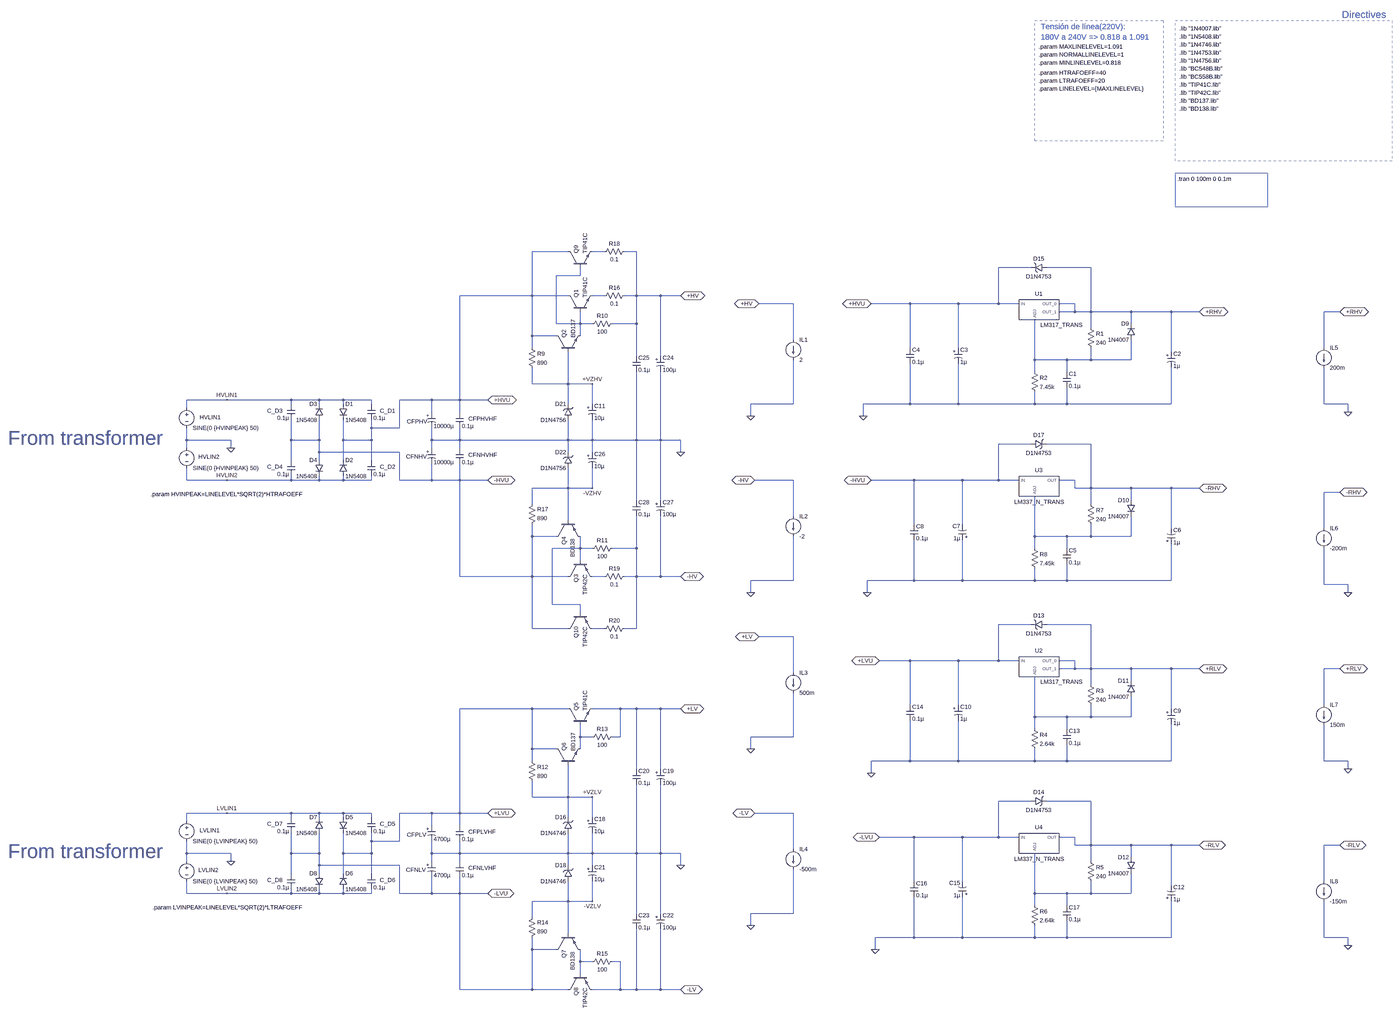
[diagram p0: schematic power_supply_V_1.0b.asc, whole sheet]
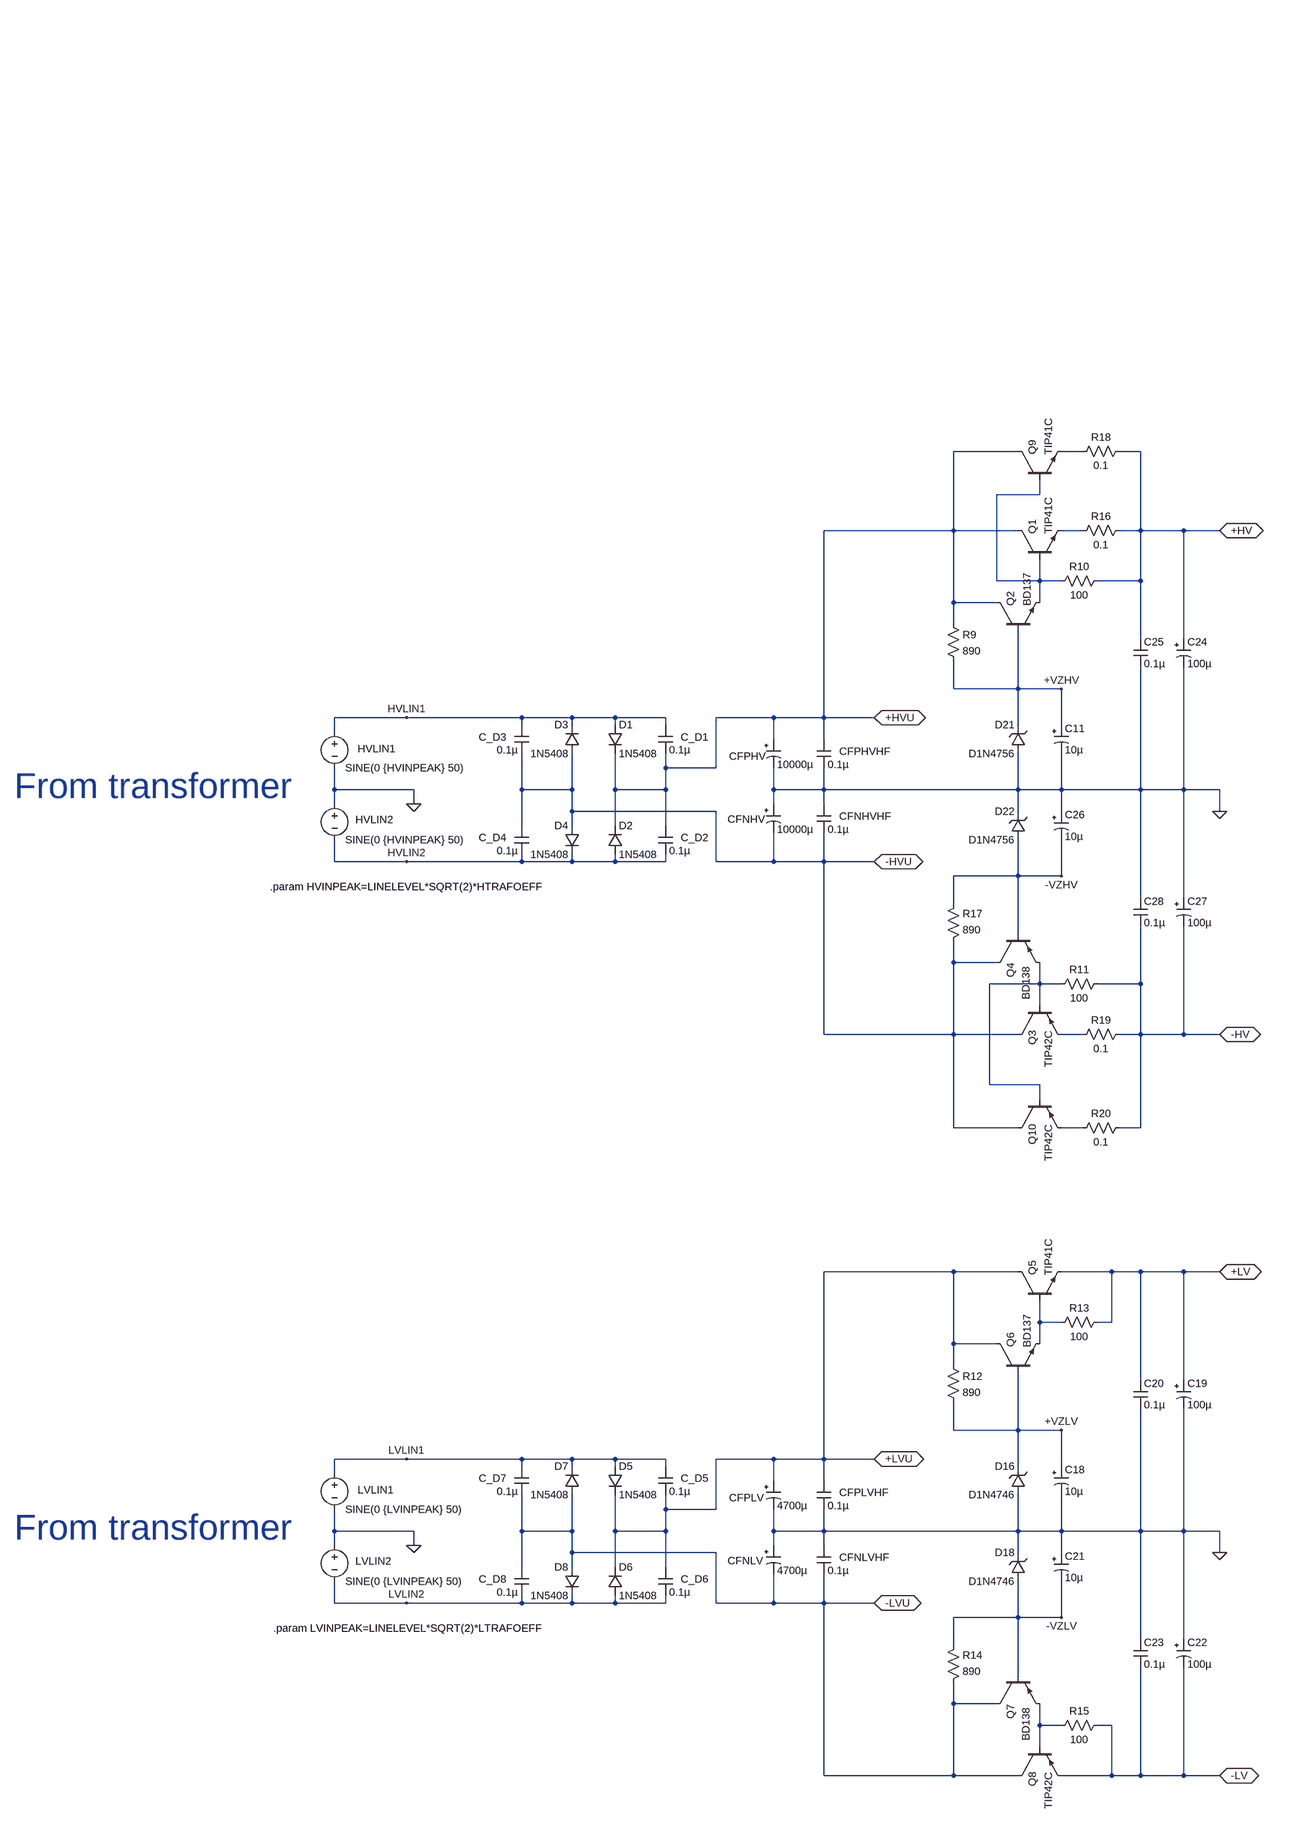
[diagram p1: schematic power_supply_V_1.0b.asc, part, row 1 of 1, column 1 of 2]
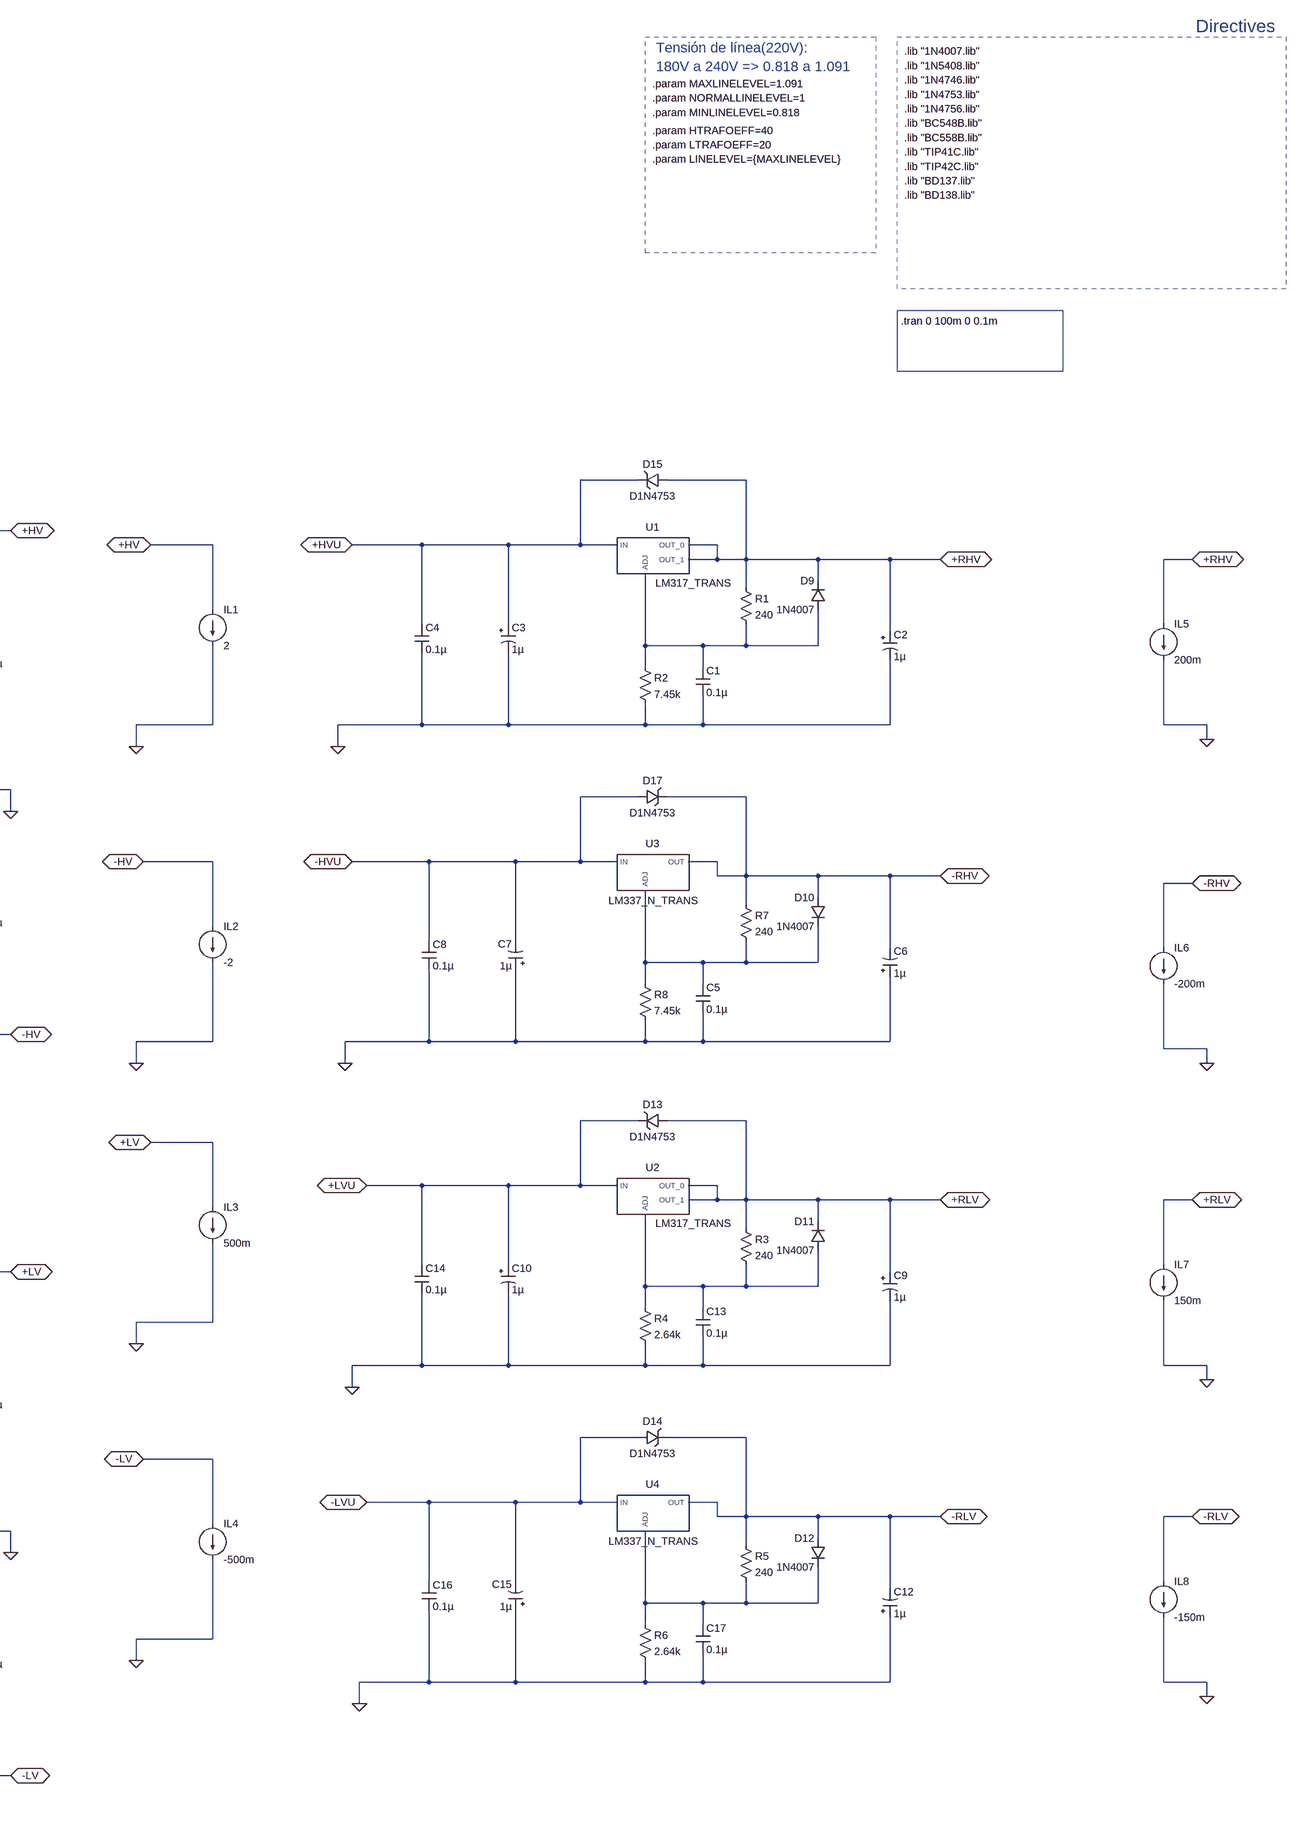
[diagram p2: schematic power_supply_V_1.0b.asc, part, row 1 of 1, column 2 of 2]
power_supply_V_1.0b.asc, the LTspice schematic file:
Version 4
SHEET 1 5728 3116
WIRE 240 -688 96 -688
WIRE 384 -688 336 -688
WIRE 512 -688 464 -688
WIRE 3248 -624 3120 -624
WIRE 3488 -624 3312 -624
WIRE 288 -592 288 -624
WIRE 288 -592 192 -592
WIRE 96 -512 96 -688
WIRE 96 -512 -192 -512
WIRE 240 -512 96 -512
WIRE 384 -512 336 -512
WIRE 512 -512 512 -688
WIRE 512 -512 464 -512
WIRE 608 -512 512 -512
WIRE 688 -512 608 -512
WIRE 2112 -480 1936 -480
WIRE 2704 -480 2544 -480
WIRE 2896 -480 2704 -480
WIRE 3120 -480 3120 -624
WIRE 3120 -480 2896 -480
WIRE 3200 -480 3120 -480
WIRE 3424 -480 3360 -480
WIRE 3424 -448 3424 -480
WIRE 3424 -448 3360 -448
WIRE 3488 -448 3488 -624
WIRE 3488 -448 3424 -448
WIRE 3648 -448 3488 -448
WIRE 3808 -448 3648 -448
WIRE 3920 -448 3808 -448
WIRE 4480 -448 4416 -448
WIRE 192 -400 192 -592
WIRE 288 -400 288 -448
WIRE 288 -400 192 -400
WIRE 336 -400 288 -400
WIRE 512 -400 512 -512
WIRE 512 -400 416 -400
WIRE 3648 -400 3648 -448
WIRE 3488 -384 3488 -448
WIRE 96 -352 96 -512
WIRE 192 -352 96 -352
WIRE 288 -352 288 -400
WIRE 2112 -336 2112 -480
WIRE 96 -304 96 -352
WIRE 2704 -304 2704 -480
WIRE 2896 -304 2896 -480
WIRE 4416 -304 4416 -448
WIRE 3808 -288 3808 -448
WIRE 512 -272 512 -400
WIRE 608 -272 608 -512
WIRE 3264 -256 3264 -416
WIRE 3392 -256 3264 -256
WIRE 3488 -256 3488 -304
WIRE 3488 -256 3392 -256
WIRE 3648 -256 3648 -336
WIRE 3648 -256 3488 -256
WIRE 3264 -208 3264 -256
WIRE 3392 -208 3392 -256
WIRE 96 -160 96 -224
WIRE 240 -160 240 -288
WIRE 240 -160 96 -160
WIRE 336 -160 240 -160
WIRE -1120 -96 -1280 -96
WIRE -864 -96 -1120 -96
WIRE -752 -96 -864 -96
WIRE -656 -96 -752 -96
WIRE -544 -96 -656 -96
WIRE -304 -96 -432 -96
WIRE -192 -96 -192 -512
WIRE -192 -96 -304 -96
WIRE -80 -96 -192 -96
WIRE -864 -80 -864 -96
WIRE -752 -80 -752 -96
WIRE -656 -80 -656 -96
WIRE -544 -80 -544 -96
WIRE 240 -80 240 -160
WIRE 336 -80 336 -160
WIRE 2112 -80 2112 -256
WIRE 2112 -80 1904 -80
WIRE 2704 -80 2704 -240
WIRE 2704 -80 2512 -80
WIRE 2896 -80 2896 -240
WIRE 2896 -80 2704 -80
WIRE 3264 -80 3264 -128
WIRE 3264 -80 2896 -80
WIRE 3392 -80 3392 -144
WIRE 3392 -80 3264 -80
WIRE 3808 -80 3808 -224
WIRE 3808 -80 3392 -80
WIRE 4416 -80 4416 -224
WIRE 4512 -80 4416 -80
WIRE -1280 -64 -1280 -96
WIRE -304 -48 -304 -96
WIRE -192 -48 -192 -96
WIRE 4512 -48 4512 -80
WIRE 1904 -32 1904 -80
WIRE 2512 -32 2512 -80
WIRE -544 16 -544 -16
WIRE -432 16 -432 -96
WIRE -432 16 -544 16
WIRE -1280 64 -1280 16
WIRE -1104 64 -1280 64
WIRE -864 64 -864 -16
WIRE -752 64 -752 -16
WIRE -752 64 -864 64
WIRE -656 64 -656 -16
WIRE -544 64 -544 16
WIRE -544 64 -656 64
WIRE -304 64 -304 16
WIRE -192 64 -192 16
WIRE -192 64 -304 64
WIRE 240 64 240 -16
WIRE 240 64 -192 64
WIRE 336 64 336 -16
WIRE 336 64 240 64
WIRE 512 64 512 -208
WIRE 512 64 336 64
WIRE 608 64 608 -208
WIRE 608 64 512 64
WIRE 688 64 608 64
WIRE 3248 80 3120 80
WIRE 3488 80 3312 80
WIRE -1280 96 -1280 64
WIRE -1104 96 -1104 64
WIRE -304 96 -304 64
WIRE -192 96 -192 64
WIRE -752 112 -752 64
WIRE -432 112 -752 112
WIRE 240 112 240 64
WIRE 336 112 336 64
WIRE 688 112 688 64
WIRE -864 144 -864 64
WIRE -752 144 -752 112
WIRE -656 144 -656 64
WIRE -544 144 -544 64
WIRE -1280 224 -1280 176
WIRE -1120 224 -1280 224
WIRE -864 224 -864 208
WIRE -864 224 -1120 224
WIRE -752 224 -752 208
WIRE -752 224 -864 224
WIRE -656 224 -656 208
WIRE -656 224 -752 224
WIRE -544 224 -544 208
WIRE -544 224 -656 224
WIRE -432 224 -432 112
WIRE -304 224 -304 160
WIRE -304 224 -432 224
WIRE -192 224 -192 160
WIRE -192 224 -304 224
WIRE -80 224 -192 224
WIRE 2112 224 1920 224
WIRE 2720 224 2544 224
WIRE 2912 224 2720 224
WIRE 3120 224 3120 80
WIRE 3120 224 2912 224
WIRE 3200 224 3120 224
WIRE 3424 224 3360 224
WIRE 240 256 240 176
WIRE 240 256 96 256
WIRE 336 256 336 176
WIRE 336 256 240 256
WIRE 3424 256 3424 224
WIRE 3488 256 3488 80
WIRE 3488 256 3424 256
WIRE 3648 256 3488 256
WIRE 3808 256 3648 256
WIRE 3920 256 3808 256
WIRE 4480 272 4416 272
WIRE 512 304 512 64
WIRE 608 304 608 64
WIRE 3648 304 3648 256
WIRE 96 320 96 256
WIRE 3488 320 3488 256
WIRE 2112 368 2112 224
WIRE 240 384 240 256
WIRE 2720 400 2720 224
WIRE 2912 400 2912 224
WIRE 3808 416 3808 256
WIRE 4416 416 4416 272
WIRE 96 448 96 400
WIRE 192 448 96 448
WIRE 3264 448 3264 288
WIRE 3392 448 3264 448
WIRE 3488 448 3488 400
WIRE 3488 448 3392 448
WIRE 3648 448 3648 368
WIRE 3648 448 3488 448
WIRE 288 496 288 448
WIRE 288 496 176 496
WIRE 336 496 288 496
WIRE 512 496 512 368
WIRE 512 496 416 496
WIRE 3264 496 3264 448
WIRE 3392 496 3392 448
WIRE 288 544 288 496
WIRE -192 608 -192 224
WIRE 96 608 96 448
WIRE 96 608 -192 608
WIRE 240 608 96 608
WIRE 384 608 336 608
WIRE 512 608 512 496
WIRE 512 608 464 608
WIRE 608 608 608 368
WIRE 608 608 512 608
WIRE 688 608 608 608
WIRE 2112 624 2112 448
WIRE 2112 624 1904 624
WIRE 2720 624 2720 464
WIRE 2720 624 2528 624
WIRE 2912 624 2912 464
WIRE 2912 624 2720 624
WIRE 3264 624 3264 576
WIRE 3264 624 2912 624
WIRE 3392 624 3392 560
WIRE 3392 624 3264 624
WIRE 3808 624 3808 480
WIRE 3808 624 3392 624
WIRE 4416 640 4416 496
WIRE 4512 640 4416 640
WIRE 1904 672 1904 624
WIRE 2528 672 2528 624
WIRE 4512 672 4512 640
WIRE 176 720 176 496
WIRE 288 720 176 720
WIRE 288 752 288 720
WIRE 3248 800 3120 800
WIRE 3488 800 3312 800
WIRE 96 816 96 608
WIRE 240 816 96 816
WIRE 384 816 336 816
WIRE 512 816 512 608
WIRE 512 816 464 816
WIRE 2112 848 1936 848
WIRE 2704 944 2576 944
WIRE 2896 944 2704 944
WIRE 3120 944 3120 800
WIRE 3120 944 2896 944
WIRE 3200 944 3120 944
WIRE 3424 944 3360 944
WIRE 3424 976 3424 944
WIRE 3424 976 3360 976
WIRE 3488 976 3488 800
WIRE 3488 976 3424 976
WIRE 3648 976 3488 976
WIRE 3808 976 3648 976
WIRE 3920 976 3808 976
WIRE 4480 976 4416 976
WIRE 2112 992 2112 848
WIRE 3648 1024 3648 976
WIRE 3488 1040 3488 976
WIRE 2704 1120 2704 944
WIRE 2896 1120 2896 944
WIRE 4416 1120 4416 976
WIRE 96 1136 -192 1136
WIRE 240 1136 96 1136
WIRE 448 1136 336 1136
WIRE 512 1136 448 1136
WIRE 608 1136 512 1136
WIRE 688 1136 608 1136
WIRE 3808 1136 3808 976
WIRE 3264 1168 3264 1008
WIRE 3392 1168 3264 1168
WIRE 3488 1168 3488 1120
WIRE 3488 1168 3392 1168
WIRE 3648 1168 3648 1088
WIRE 3648 1168 3488 1168
WIRE 3264 1216 3264 1168
WIRE 3392 1216 3392 1168
WIRE 288 1248 288 1200
WIRE 336 1248 288 1248
WIRE 448 1248 448 1136
WIRE 448 1248 416 1248
WIRE 2112 1248 2112 1072
WIRE 2112 1248 1904 1248
WIRE 96 1296 96 1136
WIRE 192 1296 96 1296
WIRE 288 1296 288 1248
WIRE 1904 1296 1904 1248
WIRE 96 1344 96 1296
WIRE 2704 1344 2704 1184
WIRE 2704 1344 2544 1344
WIRE 2896 1344 2896 1184
WIRE 2896 1344 2704 1344
WIRE 3264 1344 3264 1296
WIRE 3264 1344 2896 1344
WIRE 3392 1344 3392 1280
WIRE 3392 1344 3264 1344
WIRE 3808 1344 3808 1200
WIRE 3808 1344 3392 1344
WIRE 4416 1344 4416 1200
WIRE 4512 1344 4416 1344
WIRE 512 1376 512 1136
WIRE 608 1376 608 1136
WIRE 4512 1376 4512 1344
WIRE 2544 1392 2544 1344
WIRE 96 1488 96 1424
WIRE 240 1488 240 1360
WIRE 240 1488 96 1488
WIRE 336 1488 240 1488
WIRE 3248 1504 3120 1504
WIRE 3488 1504 3312 1504
WIRE -1120 1552 -1280 1552
WIRE -864 1552 -1120 1552
WIRE -752 1552 -864 1552
WIRE -656 1552 -752 1552
WIRE -544 1552 -656 1552
WIRE -304 1552 -432 1552
WIRE -192 1552 -192 1136
WIRE -192 1552 -304 1552
WIRE -80 1552 -192 1552
WIRE 2112 1552 1920 1552
WIRE -864 1568 -864 1552
WIRE -752 1568 -752 1552
WIRE -656 1568 -656 1552
WIRE -544 1568 -544 1552
WIRE 240 1568 240 1488
WIRE 336 1568 336 1488
WIRE -1280 1584 -1280 1552
WIRE -304 1600 -304 1552
WIRE -192 1600 -192 1552
WIRE 2720 1648 2576 1648
WIRE 2912 1648 2720 1648
WIRE 3120 1648 3120 1504
WIRE 3120 1648 2912 1648
WIRE 3200 1648 3120 1648
WIRE 3424 1648 3360 1648
WIRE -544 1664 -544 1632
WIRE -432 1664 -432 1552
WIRE -432 1664 -544 1664
WIRE 3424 1680 3424 1648
WIRE 3488 1680 3488 1504
WIRE 3488 1680 3424 1680
WIRE 3648 1680 3488 1680
WIRE 3808 1680 3648 1680
WIRE 3920 1680 3808 1680
WIRE 4480 1680 4416 1680
WIRE 2112 1696 2112 1552
WIRE -1280 1712 -1280 1664
WIRE -1104 1712 -1280 1712
WIRE -864 1712 -864 1632
WIRE -752 1712 -752 1632
WIRE -752 1712 -864 1712
WIRE -656 1712 -656 1632
WIRE -544 1712 -544 1664
WIRE -544 1712 -656 1712
WIRE -304 1712 -304 1664
WIRE -192 1712 -192 1664
WIRE -192 1712 -304 1712
WIRE 240 1712 240 1632
WIRE 240 1712 -192 1712
WIRE 336 1712 336 1632
WIRE 336 1712 240 1712
WIRE 512 1712 512 1440
WIRE 512 1712 336 1712
WIRE 608 1712 608 1440
WIRE 608 1712 512 1712
WIRE 688 1712 608 1712
WIRE 3648 1728 3648 1680
WIRE -1280 1744 -1280 1712
WIRE -1104 1744 -1104 1712
WIRE -304 1744 -304 1712
WIRE -192 1744 -192 1712
WIRE 3488 1744 3488 1680
WIRE -752 1760 -752 1712
WIRE -432 1760 -752 1760
WIRE 240 1760 240 1712
WIRE 336 1760 336 1712
WIRE 688 1760 688 1712
WIRE -864 1792 -864 1712
WIRE -752 1792 -752 1760
WIRE -656 1792 -656 1712
WIRE -544 1792 -544 1712
WIRE 2720 1824 2720 1648
WIRE 2912 1824 2912 1648
WIRE 4416 1824 4416 1680
WIRE 3808 1840 3808 1680
WIRE -1280 1872 -1280 1824
WIRE -1120 1872 -1280 1872
WIRE -864 1872 -864 1856
WIRE -864 1872 -1120 1872
WIRE -752 1872 -752 1856
WIRE -752 1872 -864 1872
WIRE -656 1872 -656 1856
WIRE -656 1872 -752 1872
WIRE -544 1872 -544 1856
WIRE -544 1872 -656 1872
WIRE -432 1872 -432 1760
WIRE -304 1872 -304 1808
WIRE -304 1872 -432 1872
WIRE -192 1872 -192 1808
WIRE -192 1872 -304 1872
WIRE -80 1872 -192 1872
WIRE 3264 1872 3264 1712
WIRE 3392 1872 3264 1872
WIRE 3488 1872 3488 1824
WIRE 3488 1872 3392 1872
WIRE 3648 1872 3648 1792
WIRE 3648 1872 3488 1872
WIRE 240 1904 240 1824
WIRE 240 1904 96 1904
WIRE 336 1904 336 1824
WIRE 336 1904 240 1904
WIRE 3264 1920 3264 1872
WIRE 3392 1920 3392 1872
WIRE 512 1952 512 1712
WIRE 608 1952 608 1712
WIRE 2112 1952 2112 1776
WIRE 2112 1952 1904 1952
WIRE 96 1968 96 1904
WIRE 1904 2000 1904 1952
WIRE 240 2032 240 1904
WIRE 2720 2048 2720 1888
WIRE 2720 2048 2560 2048
WIRE 2912 2048 2912 1888
WIRE 2912 2048 2720 2048
WIRE 3264 2048 3264 2000
WIRE 3264 2048 2912 2048
WIRE 3392 2048 3392 1984
WIRE 3392 2048 3264 2048
WIRE 3808 2048 3808 1904
WIRE 3808 2048 3392 2048
WIRE 4416 2048 4416 1904
WIRE 4512 2048 4416 2048
WIRE 4512 2080 4512 2048
WIRE 96 2096 96 2048
WIRE 192 2096 96 2096
WIRE 2560 2096 2560 2048
WIRE 288 2144 288 2096
WIRE 336 2144 288 2144
WIRE 448 2144 416 2144
WIRE 288 2192 288 2144
WIRE -192 2256 -192 1872
WIRE 96 2256 96 2096
WIRE 96 2256 -192 2256
WIRE 240 2256 96 2256
WIRE 448 2256 448 2144
WIRE 448 2256 336 2256
WIRE 512 2256 512 2016
WIRE 512 2256 448 2256
WIRE 608 2256 608 2016
WIRE 608 2256 512 2256
WIRE 688 2256 608 2256
FLAG -1120 -96 HVLIN1
FLAG -1120 224 HVLIN2
FLAG -1104 96 0
FLAG -80 -96 +HVU
IOPIN -80 -96 BiDir
FLAG 2544 -480 +HVU
IOPIN 2544 -480 BiDir
FLAG -80 224 -HVU
IOPIN -80 224 BiDir
FLAG 2544 224 -HVU
IOPIN 2544 224 BiDir
FLAG 2512 -32 0
FLAG 3920 -448 +RHV
IOPIN 3920 -448 BiDir
FLAG 2528 672 0
FLAG 3920 256 -RHV
IOPIN 3920 256 BiDir
FLAG 688 -512 +HV
IOPIN 688 -512 BiDir
FLAG 336 -160 +VZHV
FLAG 688 608 -HV
IOPIN 688 608 BiDir
FLAG 336 256 -VZHV
FLAG 688 112 0
FLAG 2576 944 +LVU
IOPIN 2576 944 BiDir
FLAG 2576 1648 -LVU
IOPIN 2576 1648 BiDir
FLAG 2544 1392 0
FLAG 3920 976 +RLV
IOPIN 3920 976 BiDir
FLAG 2560 2096 0
FLAG 3920 1680 -RLV
IOPIN 3920 1680 BiDir
FLAG -1120 1552 LVLIN1
FLAG -1120 1872 LVLIN2
FLAG -1104 1744 0
FLAG -80 1552 +LVU
IOPIN -80 1552 BiDir
FLAG -80 1872 -LVU
IOPIN -80 1872 BiDir
FLAG 688 1136 +LV
IOPIN 688 1136 BiDir
FLAG 336 1488 +VZLV
FLAG 688 2256 -LV
IOPIN 688 2256 BiDir
FLAG 336 1904 -VZLV
FLAG 688 1760 0
FLAG 1936 -480 +HV
IOPIN 1936 -480 BiDir
FLAG 1904 -32 0
FLAG 1920 224 -HV
IOPIN 1920 224 BiDir
FLAG 1904 672 0
FLAG 4480 -448 +RHV
IOPIN 4480 -448 BiDir
FLAG 4512 -48 0
FLAG 4480 272 -RHV
IOPIN 4480 272 BiDir
FLAG 4512 672 0
FLAG 4480 976 +RLV
IOPIN 4480 976 BiDir
FLAG 4512 1376 0
FLAG 4480 1680 -RLV
IOPIN 4480 1680 BiDir
FLAG 4512 2080 0
FLAG 1936 848 +LV
IOPIN 1936 848 BiDir
FLAG 1904 1296 0
FLAG 1920 1552 -LV
IOPIN 1920 1552 BiDir
FLAG 1904 2000 0
SYMBOL voltage -1280 -80 R0
WINDOW 123 0 0 Left 2
WINDOW 39 0 0 Left 2
WINDOW 0 51 53 Left 2
SYMATTR InstName HVLIN1
SYMATTR Value SINE(0 {HVINPEAK} 50)
SYMBOL diode -672 -80 R0
SYMATTR InstName D1
SYMATTR Value 1N5408
SYMBOL diode -672 208 M180
WINDOW 0 24 64 Left 2
WINDOW 3 24 0 Left 2
SYMATTR InstName D2
SYMATTR Value 1N5408
SYMBOL polcap -320 -48 R0
WINDOW 0 -83 38 Left 2
WINDOW 3 24 56 Left 2
SYMATTR InstName CFPHV
SYMATTR Value 10000µ
SYMATTR Description Capacitor
SYMATTR Type cap
SYMATTR SpiceLine V=35 Irms=1.45 Rser=0.044 Lser=0 mfg="Nichicon" pn="UPR1V222MRH" type="Al electrolytic"
SYMBOL cap -208 -48 R0
WINDOW 0 50 27 Left 2
SYMATTR InstName CFPHVHF
SYMATTR Value 0.1µ
SYMATTR SpiceLine V=4 Irms=1.62 Rser=0.0464862 Lser=0 mfg="KEMET" pn="C0402C104K7PAC" type="X5R"
SYMBOL diode -736 -16 R180
WINDOW 0 24 64 Left 2
WINDOW 3 24 0 Left 2
SYMATTR InstName D3
SYMATTR Value 1N5408
SYMBOL diode -736 144 M0
SYMATTR InstName D4
SYMATTR Value 1N5408
SYMBOL voltage -1280 80 R0
WINDOW 123 0 0 Left 2
WINDOW 39 0 0 Left 2
WINDOW 0 46 51 Left 2
SYMATTR InstName HVLIN2
SYMATTR Value SINE(0 {HVINPEAK} 50)
SYMBOL polcap -320 96 R0
WINDOW 0 -86 34 Left 2
WINDOW 3 24 56 Left 2
SYMATTR InstName CFNHV
SYMATTR Value 10000µ
SYMATTR Description Capacitor
SYMATTR Type cap
SYMATTR SpiceLine V=35 Irms=1.45 Rser=0.044 Lser=0 mfg="Nichicon" pn="UPR1V222MRH" type="Al electrolytic"
SYMBOL cap -208 96 R0
WINDOW 0 50 27 Left 2
SYMATTR InstName CFNHVHF
SYMATTR Value 0.1µ
SYMATTR SpiceLine V=4 Irms=1.62 Rser=0.0464862 Lser=0 mfg="KEMET" pn="C0402C104K7PAC" type="X5R"
SYMBOL LM317_TRANS 3280 -464 R0
WINDOW 3 91 53 Top 2
SYMATTR InstName U1
SYMBOL diode 3664 -336 R180
WINDOW 0 24 64 Left 2
WINDOW 3 24 0 Left 2
SYMATTR InstName D9
SYMATTR Value 1N4007
SYMBOL res 3472 -400 R0
SYMATTR InstName R1
SYMATTR Value 240
SYMBOL res 3248 -224 R0
SYMATTR InstName R2
SYMATTR Value 7.45k
SYMBOL polcap 3792 -288 R0
SYMATTR InstName C2
SYMATTR Value 1µ
SYMBOL polcap 2880 -304 R0
SYMATTR InstName C3
SYMATTR Value 1µ
SYMBOL diode 3664 304 M0
SYMATTR InstName D10
SYMATTR Value 1N4007
SYMBOL res 3472 304 R0
SYMATTR InstName R7
SYMATTR Value 240
SYMBOL res 3248 480 R0
SYMATTR InstName R8
SYMATTR Value 7.45k
SYMBOL polcap 3792 480 M180
WINDOW 0 24 57 Left 2
WINDOW 3 24 8 Left 2
SYMATTR InstName C6
SYMATTR Value 1µ
SYMBOL LM337_N_TRANS 3280 240 R0
SYMATTR InstName U3
SYMBOL cap 3376 -208 R0
SYMATTR InstName C1
SYMATTR Value 0.1µ
SYMBOL cap 2688 -304 R0
SYMATTR InstName C4
SYMATTR Value 0.1µ
SYMBOL polcap 2928 464 R180
WINDOW 0 24 57 Left 2
WINDOW 3 24 8 Left 2
SYMATTR InstName C7
SYMATTR Value 1µ
SYMBOL cap 2704 400 R0
SYMATTR InstName C8
SYMATTR Value 0.1µ
SYMBOL cap 3376 496 R0
SYMATTR InstName C5
SYMATTR Value 0.1µ
SYMBOL cap -560 -80 R0
WINDOW 0 50 27 Left 2
SYMATTR InstName C_D1
SYMATTR Value 0.1µ
SYMATTR SpiceLine V=4 Irms=1.62 Rser=0.0464862 Lser=0 mfg="KEMET" pn="C0402C104K7PAC" type="X5R"
SYMBOL cap -560 144 R0
WINDOW 0 50 27 Left 2
SYMATTR InstName C_D2
SYMATTR Value 0.1µ
SYMATTR SpiceLine V=4 Irms=1.62 Rser=0.0464862 Lser=0 mfg="KEMET" pn="C0402C104K7PAC" type="X5R"
SYMBOL cap -848 -80 M0
WINDOW 0 50 27 Left 2
SYMATTR InstName C_D3
SYMATTR Value 0.1µ
SYMATTR SpiceLine V=4 Irms=1.62 Rser=0.0464862 Lser=0 mfg="KEMET" pn="C0402C104K7PAC" type="X5R"
SYMBOL cap -848 144 M0
WINDOW 0 50 27 Left 2
SYMATTR InstName C_D4
SYMATTR Value 0.1µ
SYMATTR SpiceLine V=4 Irms=1.62 Rser=0.0464862 Lser=0 mfg="KEMET" pn="C0402C104K7PAC" type="X5R"
SYMBOL npn 240 -448 R270
SYMATTR InstName Q1
SYMATTR Value TIP41C
SYMBOL zener 3312 -640 R90
WINDOW 0 -4 32 VBottom 2
WINDOW 3 36 32 VTop 2
SYMATTR InstName D15
SYMATTR Value D1N4753
SYMBOL zener 3248 64 M90
WINDOW 0 -4 32 VBottom 2
WINDOW 3 36 32 VTop 2
SYMATTR InstName D17
SYMATTR Value D1N4753
SYMBOL zener 256 -16 R180
WINDOW 0 24 64 Left 2
WINDOW 3 24 0 Left 2
SYMATTR InstName D21
SYMATTR Value D1N4756
SYMBOL res 80 -320 R0
SYMATTR InstName R9
SYMATTR Value 890
SYMBOL npn 192 -288 R270
SYMATTR InstName Q2
SYMATTR Value BD137
SYMBOL polcap 320 -80 R0
SYMATTR InstName C11
SYMATTR Value 10µ
SYMBOL polcap 592 -272 R0
SYMATTR InstName C24
SYMATTR Value 100µ
SYMBOL cap 496 -272 R0
SYMATTR InstName C25
SYMATTR Value 0.1µ
SYMBOL zener 256 176 R180
WINDOW 0 24 64 Left 2
WINDOW 3 24 0 Left 2
SYMATTR InstName D22
SYMATTR Value D1N4756
SYMBOL res 80 416 M180
WINDOW 0 36 76 Left 2
WINDOW 3 36 40 Left 2
SYMATTR InstName R17
SYMATTR Value 890
SYMBOL polcap 320 112 R0
SYMATTR InstName C26
SYMATTR Value 10µ
SYMBOL polcap 592 304 R0
SYMATTR InstName C27
SYMATTR Value 100µ
SYMBOL cap 496 368 M180
WINDOW 0 24 56 Left 2
WINDOW 3 24 8 Left 2
SYMATTR InstName C28
SYMATTR Value 0.1µ
SYMBOL pnp 192 384 M90
WINDOW 0 66 32 Left 2
WINDOW 3 73 66 Left 2
SYMATTR InstName Q4
SYMATTR Value BD138
SYMBOL pnp 240 544 M90
SYMATTR InstName Q3
SYMATTR Value TIP42C
SYMBOL LM317_TRANS 3280 960 R0
WINDOW 3 91 53 Top 2
SYMATTR InstName U2
SYMBOL diode 3664 1088 R180
WINDOW 0 24 64 Left 2
WINDOW 3 24 0 Left 2
SYMATTR InstName D11
SYMATTR Value 1N4007
SYMBOL res 3472 1024 R0
SYMATTR InstName R3
SYMATTR Value 240
SYMBOL res 3248 1200 R0
SYMATTR InstName R4
SYMATTR Value 2.64k
SYMBOL polcap 3792 1136 R0
SYMATTR InstName C9
SYMATTR Value 1µ
SYMBOL polcap 2880 1120 R0
SYMATTR InstName C10
SYMATTR Value 1µ
SYMBOL diode 3664 1728 M0
SYMATTR InstName D12
SYMATTR Value 1N4007
SYMBOL res 3472 1728 R0
SYMATTR InstName R5
SYMATTR Value 240
SYMBOL res 3248 1904 R0
SYMATTR InstName R6
SYMATTR Value 2.64k
SYMBOL polcap 3792 1904 M180
WINDOW 0 24 57 Left 2
WINDOW 3 24 8 Left 2
SYMATTR InstName C12
SYMATTR Value 1µ
SYMBOL LM337_N_TRANS 3280 1664 R0
SYMATTR InstName U4
SYMBOL cap 3376 1216 R0
SYMATTR InstName C13
SYMATTR Value 0.1µ
SYMBOL cap 2688 1120 R0
SYMATTR InstName C14
SYMATTR Value 0.1µ
SYMBOL polcap 2928 1888 R180
WINDOW 0 24 57 Left 2
WINDOW 3 24 8 Left 2
SYMATTR InstName C15
SYMATTR Value 1µ
SYMBOL cap 2704 1824 R0
SYMATTR InstName C16
SYMATTR Value 0.1µ
SYMBOL cap 3376 1920 R0
SYMATTR InstName C17
SYMATTR Value 0.1µ
SYMBOL zener 3312 784 R90
WINDOW 0 -4 32 VBottom 2
WINDOW 3 36 32 VTop 2
SYMATTR InstName D13
SYMATTR Value D1N4753
SYMBOL zener 3248 1488 M90
WINDOW 0 -4 32 VBottom 2
WINDOW 3 36 32 VTop 2
SYMATTR InstName D14
SYMATTR Value D1N4753
SYMBOL voltage -1280 1568 R0
WINDOW 123 0 0 Left 2
WINDOW 39 0 0 Left 2
WINDOW 0 51 53 Left 2
SYMATTR InstName LVLIN1
SYMATTR Value SINE(0 {LVINPEAK} 50)
SYMBOL diode -672 1568 R0
SYMATTR InstName D5
SYMATTR Value 1N5408
SYMBOL diode -672 1856 M180
WINDOW 0 24 64 Left 2
WINDOW 3 24 0 Left 2
SYMATTR InstName D6
SYMATTR Value 1N5408
SYMBOL polcap -320 1600 R0
WINDOW 0 -83 38 Left 2
WINDOW 3 24 56 Left 2
SYMATTR InstName CFPLV
SYMATTR Value 4700µ
SYMATTR Description Capacitor
SYMATTR Type cap
SYMATTR SpiceLine V=35 Irms=1.45 Rser=0.044 Lser=0 mfg="Nichicon" pn="UPR1V222MRH" type="Al electrolytic"
SYMBOL cap -208 1600 R0
WINDOW 0 50 27 Left 2
SYMATTR InstName CFPLVHF
SYMATTR Value 0.1µ
SYMATTR SpiceLine V=4 Irms=1.62 Rser=0.0464862 Lser=0 mfg="KEMET" pn="C0402C104K7PAC" type="X5R"
SYMBOL diode -736 1632 R180
WINDOW 0 24 64 Left 2
WINDOW 3 24 0 Left 2
SYMATTR InstName D7
SYMATTR Value 1N5408
SYMBOL diode -736 1792 M0
SYMATTR InstName D8
SYMATTR Value 1N5408
SYMBOL voltage -1280 1728 R0
WINDOW 123 0 0 Left 2
WINDOW 39 0 0 Left 2
WINDOW 0 46 51 Left 2
SYMATTR InstName LVLIN2
SYMATTR Value SINE(0 {LVINPEAK} 50)
SYMBOL polcap -320 1744 R0
WINDOW 0 -86 34 Left 2
WINDOW 3 24 56 Left 2
SYMATTR InstName CFNLV
SYMATTR Value 4700µ
SYMATTR Description Capacitor
SYMATTR Type cap
SYMATTR SpiceLine V=35 Irms=1.45 Rser=0.044 Lser=0 mfg="Nichicon" pn="UPR1V222MRH" type="Al electrolytic"
SYMBOL cap -208 1744 R0
WINDOW 0 50 27 Left 2
SYMATTR InstName CFNLVHF
SYMATTR Value 0.1µ
SYMATTR SpiceLine V=4 Irms=1.62 Rser=0.0464862 Lser=0 mfg="KEMET" pn="C0402C104K7PAC" type="X5R"
SYMBOL cap -560 1568 R0
WINDOW 0 50 27 Left 2
SYMATTR InstName C_D5
SYMATTR Value 0.1µ
SYMATTR SpiceLine V=4 Irms=1.62 Rser=0.0464862 Lser=0 mfg="KEMET" pn="C0402C104K7PAC" type="X5R"
SYMBOL cap -560 1792 R0
WINDOW 0 50 27 Left 2
SYMATTR InstName C_D6
SYMATTR Value 0.1µ
SYMATTR SpiceLine V=4 Irms=1.62 Rser=0.0464862 Lser=0 mfg="KEMET" pn="C0402C104K7PAC" type="X5R"
SYMBOL cap -848 1568 M0
WINDOW 0 50 27 Left 2
SYMATTR InstName C_D7
SYMATTR Value 0.1µ
SYMATTR SpiceLine V=4 Irms=1.62 Rser=0.0464862 Lser=0 mfg="KEMET" pn="C0402C104K7PAC" type="X5R"
SYMBOL cap -848 1792 M0
WINDOW 0 50 27 Left 2
SYMATTR InstName C_D8
SYMATTR Value 0.1µ
SYMATTR SpiceLine V=4 Irms=1.62 Rser=0.0464862 Lser=0 mfg="KEMET" pn="C0402C104K7PAC" type="X5R"
SYMBOL npn 240 1200 R270
SYMATTR InstName Q5
SYMATTR Value TIP41C
SYMBOL zener 256 1632 R180
WINDOW 0 24 64 Left 2
WINDOW 3 24 0 Left 2
SYMATTR InstName D16
SYMATTR Value D1N4746
SYMBOL res 80 1328 R0
SYMATTR InstName R12
SYMATTR Value 890
SYMBOL npn 192 1360 R270
SYMATTR InstName Q6
SYMATTR Value BD137
SYMBOL polcap 320 1568 R0
SYMATTR InstName C18
SYMATTR Value 10µ
SYMBOL polcap 592 1376 R0
SYMATTR InstName C19
SYMATTR Value 100µ
SYMBOL cap 496 1376 R0
SYMATTR InstName C20
SYMATTR Value 0.1µ
SYMBOL zener 256 1824 R180
WINDOW 0 24 64 Left 2
WINDOW 3 24 0 Left 2
SYMATTR InstName D18
SYMATTR Value D1N4746
SYMBOL res 80 2064 M180
WINDOW 0 36 76 Left 2
WINDOW 3 36 40 Left 2
SYMATTR InstName R14
SYMATTR Value 890
SYMBOL polcap 320 1760 R0
SYMATTR InstName C21
SYMATTR Value 10µ
SYMBOL polcap 592 1952 R0
SYMATTR InstName C22
SYMATTR Value 100µ
SYMBOL cap 496 2016 M180
WINDOW 0 24 56 Left 2
WINDOW 3 24 8 Left 2
SYMATTR InstName C23
SYMATTR Value 0.1µ
SYMBOL pnp 192 2032 M90
WINDOW 0 66 32 Left 2
WINDOW 3 73 66 Left 2
SYMATTR InstName Q7
SYMATTR Value BD138
SYMBOL pnp 240 2192 M90
SYMATTR InstName Q8
SYMATTR Value TIP42C
SYMBOL current 2112 -336 R0
WINDOW 123 0 0 Left 0
WINDOW 39 0 0 Left 0
SYMATTR InstName IL1
SYMATTR Value 2
SYMBOL current 2112 368 R0
WINDOW 123 0 0 Left 0
WINDOW 39 0 0 Left 0
SYMATTR InstName IL2
SYMATTR Value -2
SYMBOL current 2112 992 R0
WINDOW 123 0 0 Left 0
WINDOW 39 0 0 Left 0
SYMATTR InstName IL3
SYMATTR Value 500m
SYMBOL current 2112 1696 R0
WINDOW 123 0 0 Left 0
WINDOW 39 0 0 Left 0
SYMATTR InstName IL4
SYMATTR Value -500m
SYMBOL current 4416 -304 R0
WINDOW 123 0 0 Left 0
WINDOW 39 0 0 Left 0
SYMATTR InstName IL5
SYMATTR Value 200m
SYMBOL current 4416 416 R0
WINDOW 123 0 0 Left 0
WINDOW 39 0 0 Left 0
SYMATTR InstName IL6
SYMATTR Value -200m
SYMBOL current 4416 1120 R0
WINDOW 123 0 0 Left 0
WINDOW 39 0 0 Left 0
SYMATTR InstName IL7
SYMATTR Value 150m
SYMBOL current 4416 1824 R0
WINDOW 123 0 0 Left 0
WINDOW 39 0 0 Left 0
SYMATTR InstName IL8
SYMATTR Value -150m
SYMBOL res 432 -416 R90
WINDOW 0 0 56 VBottom 2
WINDOW 3 32 56 VTop 2
SYMATTR InstName R10
SYMATTR Value 100
SYMBOL res 432 480 R90
WINDOW 0 0 56 VBottom 2
WINDOW 3 32 56 VTop 2
SYMATTR InstName R11
SYMATTR Value 100
SYMBOL res 432 1232 R90
WINDOW 0 0 56 VBottom 2
WINDOW 3 32 56 VTop 2
SYMATTR InstName R13
SYMATTR Value 100
SYMBOL res 432 2128 R90
WINDOW 0 0 56 VBottom 2
WINDOW 3 32 56 VTop 2
SYMATTR InstName R15
SYMATTR Value 100
SYMBOL pnp 240 752 M90
SYMATTR InstName Q10
SYMATTR Value TIP42C
SYMBOL res 480 592 R90
WINDOW 0 0 56 VBottom 2
WINDOW 3 32 56 VTop 2
SYMATTR InstName R19
SYMATTR Value 0.1
SYMBOL res 480 800 R90
WINDOW 0 0 56 VBottom 2
WINDOW 3 32 56 VTop 2
SYMATTR InstName R20
SYMATTR Value 0.1
SYMBOL npn 240 -624 R270
SYMATTR InstName Q9
SYMATTR Value TIP41C
SYMBOL res 480 -528 R90
WINDOW 0 0 56 VBottom 2
WINDOW 3 32 56 VTop 2
SYMATTR InstName R16
SYMATTR Value 0.1
SYMBOL res 480 -704 R90
WINDOW 0 0 56 VBottom 2
WINDOW 3 32 56 VTop 2
SYMATTR InstName R18
SYMATTR Value 0.1
TEXT -1992 56 Left 6 ;From transformer
TEXT 3832 -1064 Left 2 !.tran 0 100m 0 0.1m
TEXT 3840 -1664 Left 2 !.lib "1N4007.lib"
TEXT 4488 -1720 Left 4 ;Directives
TEXT 3840 -1632 Left 2 !.lib "1N5408.lib"
TEXT 3840 -1568 Left 2 !.lib "1N4753.lib"
TEXT 3280 -1488 Left 2 !.param HTRAFOEFF=40
TEXT 3280 -1456 Left 2 !.param LTRAFOEFF=20
TEXT 3280 -1424 Left 2 !.param LINELEVEL={MAXLINELEVEL}
TEXT 3288 -1672 Left 3 ;Tensión de línea(220V):\n180V a 240V => 0.818 a 1.091
TEXT 3280 -1592 Left 2 !.param MAXLINELEVEL=1.091
TEXT 3280 -1528 Left 2 !.param MINLINELEVEL=0.818
TEXT 3280 -1560 Left 2 !.param NORMALLINELEVEL=1
TEXT -1424 280 Left 2 !.param HVINPEAK=LINELEVEL*SQRT(2)*HTRAFOEFF
TEXT -1416 1928 Left 2 !.param LVINPEAK=LINELEVEL*SQRT(2)*LTRAFOEFF
TEXT 3840 -1536 Left 2 !.lib "1N4756.lib"
TEXT 3840 -1504 Left 2 !.lib "BC548B.lib"
TEXT 3840 -1472 Left 2 !.lib "BC558B.lib"
TEXT 3840 -1440 Left 2 !.lib "TIP41C.lib"
TEXT 3840 -1408 Left 2 !.lib "TIP42C.lib"
TEXT -1992 1704 Left 6 ;From transformer
TEXT 3840 -1376 Left 2 !.lib "BD137.lib"
TEXT 3840 -1344 Left 2 !.lib "BD138.lib"
TEXT 3840 -1600 Left 2 !.lib "1N4746.lib"
RECTANGLE Normal 4688 -1136 3824 -1696 3
RECTANGLE Normal 3776 -1216 3264 -1696 2
RECTANGLE Normal 4192 -928 3824 -1088

The netlist it stands for:
* power_supply_V_1.0b.asc
V§HVLIN1 HVLIN1 0 SINE(0 {HVINPEAK} 50)
D1 HVLIN1 +HVU 1N5408
D2 HVLIN2 +HVU 1N5408
CFPHV +HVU 0 10000µ V=35 Irms=1.45 Rser=0.044 Lser=0 mfg="Nichicon" pn="UPR1V222MRH" type="Al electrolytic"
CFPHVHF +HVU 0 0.1µ V=4 Irms=1.62 Rser=0.0464862 Lser=0 mfg="KEMET" pn="C0402C104K7PAC" type="X5R"
D3 -HVU HVLIN1 1N5408
D4 -HVU HVLIN2 1N5408
V§HVLIN2 0 HVLIN2 SINE(0 {HVINPEAK} 50)
CFNHV 0 -HVU 10000µ V=35 Irms=1.45 Rser=0.044 Lser=0 mfg="Nichicon" pn="UPR1V222MRH" type="Al electrolytic"
CFNHVHF 0 -HVU 0.1µ V=4 Irms=1.62 Rser=0.0464862 Lser=0 mfg="KEMET" pn="C0402C104K7PAC" type="X5R"
XU1 +HVU N004 +RHV +RHV LM317_TRANS  ; pins IN ADJ OUT_0 OUT_1
D9 N004 +RHV 1N4007
R1 +RHV N004 240
R2 N004 0 7.45k
C2 +RHV 0 1µ
C3 +HVU 0 1µ
D10 -RHV N005 1N4007
R7 -RHV N005 240
R8 N005 0 7.45k
C6 0 -RHV 1µ
XU3 -HVU N005 -RHV LM337_N_TRANS  ; pins IN ADJ OUT
C1 N004 0 0.1µ
C4 +HVU 0 0.1µ
C7 0 -HVU 1µ
C8 -HVU 0 0.1µ
C5 N005 0 0.1µ
C_D1 HVLIN1 +HVU 0.1µ V=4 Irms=1.62 Rser=0.0464862 Lser=0 mfg="KEMET" pn="C0402C104K7PAC" type="X5R"
C_D2 +HVU HVLIN2 0.1µ V=4 Irms=1.62 Rser=0.0464862 Lser=0 mfg="KEMET" pn="C0402C104K7PAC" type="X5R"
C_D3 HVLIN1 -HVU 0.1µ V=4 Irms=1.62 Rser=0.0464862 Lser=0 mfg="KEMET" pn="C0402C104K7PAC" type="X5R"
C_D4 -HVU HVLIN2 0.1µ V=4 Irms=1.62 Rser=0.0464862 Lser=0 mfg="KEMET" pn="C0402C104K7PAC" type="X5R"
Q1 +HVU N002 N003 0 TIP41C
D15 +RHV +HVU D1N4753
D17 -HVU -RHV D1N4753
D21 0 +VZHV D1N4756
R9 +HVU +VZHV 890
Q2 +HVU +VZHV N002 0 BD137
C11 +VZHV 0 10µ
C24 +HV 0 100µ
C25 +HV 0 0.1µ
D22 -VZHV 0 D1N4756
R17 -HVU -VZHV 890
C26 0 -VZHV 10µ
C27 0 -HV 100µ
C28 -HV 0 0.1µ
Q4 -HVU -VZHV N006 0 BD138
Q3 -HVU N006 N007 0 TIP42C
XU2 +LVU N009 +RLV +RLV LM317_TRANS  ; pins IN ADJ OUT_0 OUT_1
D11 N009 +RLV 1N4007
R3 +RLV N009 240
R4 N009 0 2.64k
C9 +RLV 0 1µ
C10 +LVU 0 1µ
D12 -RLV N011 1N4007
R5 -RLV N011 240
R6 N011 0 2.64k
C12 0 -RLV 1µ
XU4 -LVU N011 -RLV LM337_N_TRANS  ; pins IN ADJ OUT
C13 N009 0 0.1µ
C14 +LVU 0 0.1µ
C15 0 -LVU 1µ
C16 -LVU 0 0.1µ
C17 N011 0 0.1µ
D13 +RLV +LVU D1N4753
D14 -LVU -RLV D1N4753
V§LVLIN1 LVLIN1 0 SINE(0 {LVINPEAK} 50)
D5 LVLIN1 +LVU 1N5408
D6 LVLIN2 +LVU 1N5408
CFPLV +LVU 0 4700µ V=35 Irms=1.45 Rser=0.044 Lser=0 mfg="Nichicon" pn="UPR1V222MRH" type="Al electrolytic"
CFPLVHF +LVU 0 0.1µ V=4 Irms=1.62 Rser=0.0464862 Lser=0 mfg="KEMET" pn="C0402C104K7PAC" type="X5R"
D7 -LVU LVLIN1 1N5408
D8 -LVU LVLIN2 1N5408
V§LVLIN2 0 LVLIN2 SINE(0 {LVINPEAK} 50)
CFNLV 0 -LVU 4700µ V=35 Irms=1.45 Rser=0.044 Lser=0 mfg="Nichicon" pn="UPR1V222MRH" type="Al electrolytic"
CFNLVHF 0 -LVU 0.1µ V=4 Irms=1.62 Rser=0.0464862 Lser=0 mfg="KEMET" pn="C0402C104K7PAC" type="X5R"
C_D5 LVLIN1 +LVU 0.1µ V=4 Irms=1.62 Rser=0.0464862 Lser=0 mfg="KEMET" pn="C0402C104K7PAC" type="X5R"
C_D6 +LVU LVLIN2 0.1µ V=4 Irms=1.62 Rser=0.0464862 Lser=0 mfg="KEMET" pn="C0402C104K7PAC" type="X5R"
C_D7 LVLIN1 -LVU 0.1µ V=4 Irms=1.62 Rser=0.0464862 Lser=0 mfg="KEMET" pn="C0402C104K7PAC" type="X5R"
C_D8 -LVU LVLIN2 0.1µ V=4 Irms=1.62 Rser=0.0464862 Lser=0 mfg="KEMET" pn="C0402C104K7PAC" type="X5R"
Q5 +LVU N010 +LV 0 TIP41C
D16 0 +VZLV D1N4746
R12 +LVU +VZLV 890
Q6 +LVU +VZLV N010 0 BD137
C18 +VZLV 0 10µ
C19 +LV 0 100µ
C20 +LV 0 0.1µ
D18 -VZLV 0 D1N4746
R14 -LVU -VZLV 890
C21 0 -VZLV 10µ
C22 0 -LV 100µ
C23 -LV 0 0.1µ
Q7 -LVU -VZLV N012 0 BD138
Q8 -LVU N012 -LV 0 TIP42C
IL1 +HV 0 2
IL2 -HV 0 -2
IL3 +LV 0 500m
IL4 -LV 0 -500m
IL5 +RHV 0 200m
IL6 -RHV 0 -200m
IL7 +RLV 0 150m
IL8 -RLV 0 -150m
R10 +HV N002 100
R11 -HV N006 100
R13 +LV N010 100
R15 -LV N012 100
Q10 -HVU N006 N008 0 TIP42C
R19 -HV N007 0.1
R20 -HV N008 0.1
Q9 +HVU N002 N001 0 TIP41C
R16 +HV N003 0.1
R18 +HV N001 0.1
.model D D
.lib standard.dio
.model NPN NPN
.model PNP PNP
.lib standard.bjt
* From transformer
.tran 0 100m 0 0.1m
.lib "1N4007.lib"
* Directives
.lib "1N5408.lib"
.lib "1N4753.lib"
.param HTRAFOEFF=40
.param LTRAFOEFF=20
.param LINELEVEL={MAXLINELEVEL}
* Tensión de línea(220V):
* 180V a 240V => 0.818 a 1.091
.param MAXLINELEVEL=1.091
.param MINLINELEVEL=0.818
.param NORMALLINELEVEL=1
.param HVINPEAK=LINELEVEL*SQRT(2)*HTRAFOEFF
.param LVINPEAK=LINELEVEL*SQRT(2)*LTRAFOEFF
.lib "1N4756.lib"
.lib "BC548B.lib"
.lib "BC558B.lib"
.lib "TIP41C.lib"
.lib "TIP42C.lib"
* From transformer
.lib "BD137.lib"
.lib "BD138.lib"
.lib "1N4746.lib"
.lib LM317_TRANS.LIB
.lib LM337_N_TRANS.LIB
.backanno
.end